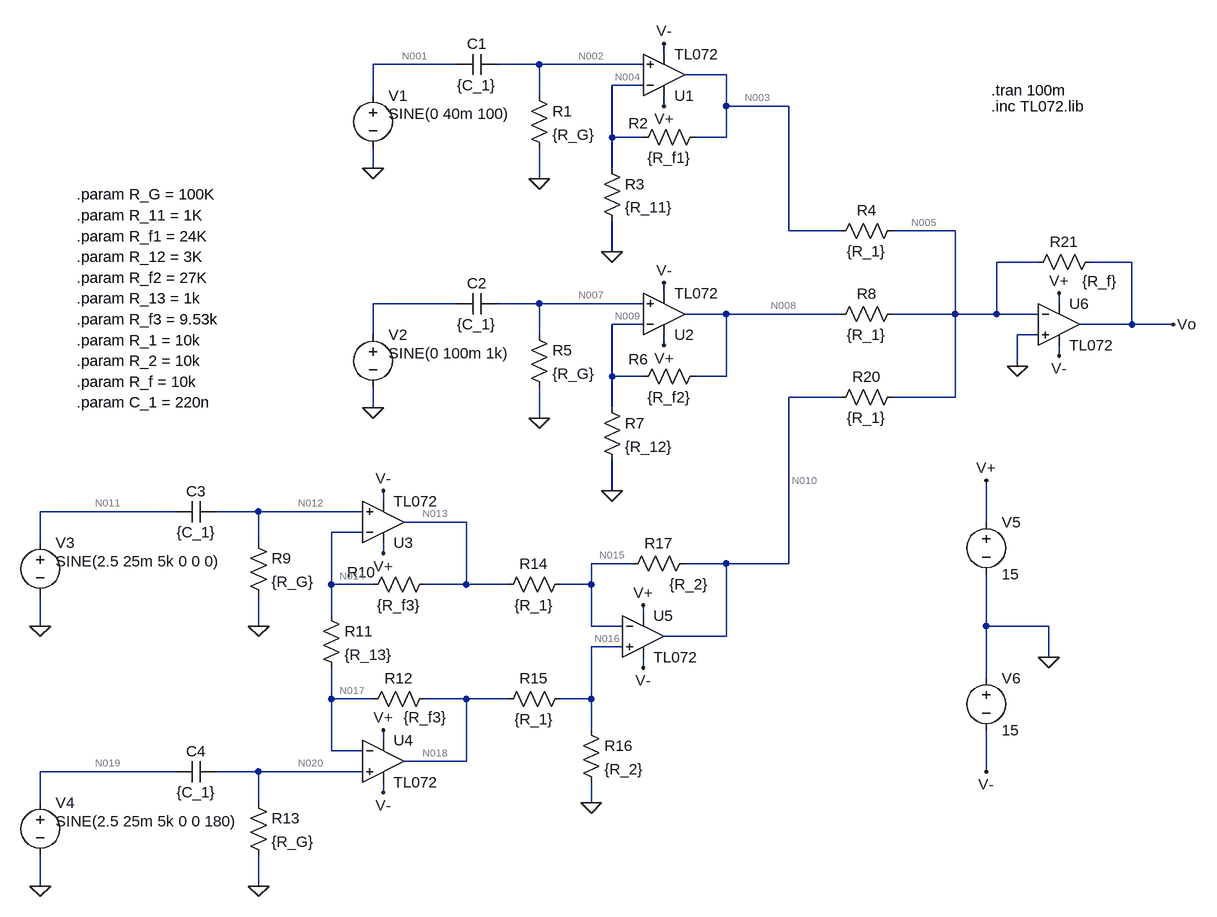
[diagram p0: schematic Mezclador.asc]
Mezclador.asc, the LTspice schematic file:
Version 4.1
SHEET 1 1080 1544
WIRE 208 80 208 64
WIRE -112 96 -240 96
WIRE 16 96 -48 96
WIRE 176 96 16 96
WIRE 304 112 240 112
WIRE 176 128 128 128
WIRE -240 144 -240 96
WIRE 16 144 16 96
WIRE 208 160 208 144
WIRE 304 160 304 112
WIRE 400 160 304 160
WIRE 128 208 128 128
WIRE 176 208 128 208
WIRE 304 208 304 160
WIRE 304 208 256 208
WIRE -240 256 -240 224
WIRE 128 256 128 208
WIRE 16 272 16 224
WIRE 400 352 400 160
WIRE 480 352 400 352
WIRE 656 352 560 352
WIRE 128 384 128 336
WIRE 784 400 720 400
WIRE 928 400 864 400
WIRE 208 448 208 432
WIRE -112 464 -240 464
WIRE 16 464 -48 464
WIRE 176 464 16 464
WIRE 816 464 816 448
WIRE 304 480 240 480
WIRE 480 480 304 480
WIRE 656 480 656 352
WIRE 656 480 560 480
WIRE 720 480 720 400
WIRE 720 480 656 480
WIRE 784 480 720 480
WIRE 176 496 128 496
WIRE 928 496 928 400
WIRE 928 496 848 496
WIRE 992 496 928 496
WIRE -240 512 -240 464
WIRE 16 512 16 464
WIRE 784 512 752 512
WIRE 208 528 208 512
WIRE 816 544 816 528
WIRE 752 560 752 512
WIRE 128 576 128 496
WIRE 176 576 128 576
WIRE 304 576 304 480
WIRE 304 576 256 576
WIRE 480 608 400 608
WIRE 656 608 656 480
WIRE 656 608 560 608
WIRE -240 624 -240 592
WIRE 128 624 128 576
WIRE 16 640 16 592
WIRE 128 752 128 704
WIRE -224 768 -224 752
WIRE -544 784 -752 784
WIRE -416 784 -480 784
WIRE -256 784 -416 784
WIRE -96 800 -192 800
WIRE 704 800 704 736
WIRE -256 816 -304 816
WIRE -752 832 -752 784
WIRE -416 832 -416 784
WIRE -224 848 -224 832
WIRE 160 864 96 864
WIRE 304 864 240 864
WIRE 400 864 400 608
WIRE 400 864 304 864
WIRE -304 896 -304 816
WIRE -240 896 -304 896
WIRE -96 896 -96 800
WIRE -96 896 -160 896
WIRE -32 896 -96 896
WIRE 96 896 96 864
WIRE 96 896 48 896
WIRE -304 944 -304 896
WIRE 176 944 176 928
WIRE -752 960 -752 912
WIRE -416 960 -416 912
WIRE 96 960 96 896
WIRE 144 960 96 960
WIRE 704 960 704 880
WIRE 800 960 704 960
WIRE 304 976 304 864
WIRE 304 976 208 976
WIRE 144 992 96 992
WIRE 800 1008 800 960
WIRE 176 1024 176 1008
WIRE 704 1040 704 960
WIRE -304 1072 -304 1024
WIRE -240 1072 -304 1072
WIRE -96 1072 -160 1072
WIRE -32 1072 -96 1072
WIRE 96 1072 96 992
WIRE 96 1072 48 1072
WIRE 96 1120 96 1072
WIRE -224 1136 -224 1120
WIRE -304 1152 -304 1072
WIRE -256 1152 -304 1152
WIRE -96 1168 -96 1072
WIRE -96 1168 -192 1168
WIRE -544 1184 -752 1184
WIRE -416 1184 -480 1184
WIRE -256 1184 -416 1184
WIRE 704 1184 704 1120
WIRE -224 1216 -224 1200
WIRE -752 1232 -752 1184
WIRE -416 1232 -416 1184
WIRE 96 1232 96 1200
WIRE -752 1360 -752 1312
WIRE -416 1360 -416 1312
FLAG 128 384 0
FLAG 128 752 0
FLAG 752 560 0
FLAG 16 272 0
FLAG 16 640 0
FLAG 992 496 Vo
FLAG -416 960 0
FLAG -416 1360 0
FLAG 96 1232 0
FLAG -752 960 0
FLAG -752 1360 0
FLAG -240 624 0
FLAG -240 256 0
FLAG 800 1008 0
FLAG 704 736 V+
FLAG 704 1184 V-
FLAG 208 160 V+
FLAG 208 528 V+
FLAG 816 448 V+
FLAG -224 848 V+
FLAG -224 1120 V+
FLAG 176 928 V+
FLAG 176 1024 V-
FLAG -224 1216 V-
FLAG -224 752 V-
FLAG 208 432 V-
FLAG 208 64 V-
FLAG 816 544 V-
SYMBOL res 272 192 R90
WINDOW 0 10 103 VBottom 2
WINDOW 3 32 56 VTop 2
SYMATTR InstName R2
SYMATTR Value {R_f1}
SYMBOL res 112 240 R0
SYMATTR InstName R3
SYMATTR Value {R_11}
SYMBOL res 272 560 R90
WINDOW 0 5 103 VBottom 2
WINDOW 3 32 56 VTop 2
SYMATTR InstName R6
SYMATTR Value {R_f2}
SYMBOL res 112 608 R0
SYMATTR InstName R7
SYMATTR Value {R_12}
SYMBOL res 576 464 R90
WINDOW 0 0 56 VBottom 2
WINDOW 3 32 56 VTop 2
SYMATTR InstName R8
SYMATTR Value {R_1}
SYMBOL res 576 336 R90
WINDOW 0 0 56 VBottom 2
WINDOW 3 32 56 VTop 2
SYMATTR InstName R4
SYMATTR Value {R_1}
SYMBOL res 576 592 R90
WINDOW 0 0 56 VBottom 2
WINDOW 3 32 56 VTop 2
SYMATTR InstName R20
SYMATTR Value {R_1}
SYMBOL res 880 384 R90
WINDOW 0 0 56 VBottom 2
WINDOW 3 30 1 VTop 2
SYMATTR InstName R21
SYMATTR Value {R_f}
SYMBOL cap -48 80 R90
WINDOW 0 0 32 VBottom 2
WINDOW 3 32 32 VTop 2
SYMATTR InstName C1
SYMATTR Value {C_1}
SYMBOL res 0 128 R0
SYMATTR InstName R1
SYMATTR Value {R_G}
SYMBOL cap -48 448 R90
WINDOW 0 0 32 VBottom 2
WINDOW 3 32 32 VTop 2
SYMATTR InstName C2
SYMATTR Value {C_1}
SYMBOL res 0 496 R0
SYMATTR InstName R5
SYMATTR Value {R_G}
SYMBOL cap -480 768 R90
WINDOW 0 0 32 VBottom 2
WINDOW 3 32 32 VTop 2
SYMATTR InstName C3
SYMATTR Value {C_1}
SYMBOL res -432 816 R0
SYMATTR InstName R9
SYMATTR Value {R_G}
SYMBOL cap -480 1168 R90
WINDOW 0 0 32 VBottom 2
WINDOW 3 32 32 VTop 2
SYMATTR InstName C4
SYMATTR Value {C_1}
SYMBOL res -432 1216 R0
SYMATTR InstName R13
SYMATTR Value {R_G}
SYMBOL res -144 880 R90
WINDOW 0 13 114 VBottom 2
WINDOW 3 32 56 VTop 2
SYMATTR InstName R10
SYMATTR Value {R_f3}
SYMBOL res -256 1088 R270
WINDOW 0 32 56 VTop 2
WINDOW 3 3 97 VBottom 2
SYMATTR InstName R12
SYMATTR Value {R_f3}
SYMBOL res -320 928 R0
SYMATTR InstName R11
SYMATTR Value {R_13}
SYMBOL res 64 1056 R90
WINDOW 0 0 56 VBottom 2
WINDOW 3 32 56 VTop 2
SYMATTR InstName R15
SYMATTR Value {R_1}
SYMBOL res 64 880 R90
WINDOW 0 0 56 VBottom 2
WINDOW 3 32 56 VTop 2
SYMATTR InstName R14
SYMATTR Value {R_1}
SYMBOL res 80 1104 R0
SYMATTR InstName R16
SYMATTR Value {R_2}
SYMBOL res 256 848 R90
WINDOW 0 0 56 VBottom 2
WINDOW 3 32 9 VTop 2
SYMATTR InstName R17
SYMATTR Value {R_2}
SYMBOL voltage -240 128 R0
WINDOW 123 24 44 Left 2
WINDOW 39 0 0 Left 0
WINDOW 3 24 44 Left 2
SYMATTR Value SINE(0 40m 100)
SYMATTR InstName V1
SYMBOL voltage -240 496 R0
WINDOW 123 24 44 Left 2
WINDOW 39 0 0 Left 0
WINDOW 3 24 44 Left 2
SYMATTR Value SINE(0 100m 1k)
SYMATTR InstName V2
SYMBOL voltage -752 816 R0
WINDOW 123 24 44 Left 2
WINDOW 39 0 0 Left 0
WINDOW 3 24 44 Left 2
SYMATTR Value SINE(2.5 25m 5k 0 0 0)
SYMATTR InstName V3
SYMBOL voltage -752 1216 R0
WINDOW 123 24 44 Left 2
WINDOW 39 0 0 Left 0
WINDOW 3 24 44 Left 2
SYMATTR Value SINE(2.5 25m 5k 0 0 180)
SYMATTR InstName V4
SYMBOL OpAmps\\opamp2 208 176 M180
SYMATTR InstName U1
SYMATTR Value TL072
SYMBOL OpAmps\\opamp2 208 544 M180
SYMATTR InstName U2
SYMATTR Value TL072
SYMBOL OpAmps\\opamp2 -224 864 M180
SYMATTR InstName U3
SYMATTR Value TL072
SYMBOL OpAmps\\opamp2 -224 1104 R0
SYMATTR InstName U4
SYMATTR Value TL072
SYMBOL OpAmps\\opamp2 176 912 R0
SYMATTR InstName U5
SYMATTR Value TL072
SYMBOL OpAmps\\opamp2 816 432 R0
SYMATTR InstName U6
SYMATTR Value TL072
SYMBOL voltage 704 784 R0
SYMATTR InstName V5
SYMATTR Value 15
SYMBOL voltage 704 1024 R0
SYMATTR InstName V6
SYMATTR Value 15
TEXT -696 328 Left 2 !.param R_11 = 1K
TEXT -696 360 Left 2 !.param R_f1 = 24K
TEXT -696 392 Left 2 !.param R_12 = 3K
TEXT -696 424 Left 2 !.param R_f2 = 27K
TEXT -696 296 Left 2 !.param R_G = 100K
TEXT -696 520 Left 2 !.param R_1 = 10k
TEXT -696 552 Left 2 !.param R_2 = 10k
TEXT -696 616 Left 2 !.param C_1 = 220n
TEXT -696 488 Left 2 !.param R_f3 = 9.53k
TEXT -696 456 Left 2 !.param R_13 = 1k
TEXT -696 584 Left 2 !.param R_f = 10k
TEXT 712 160 Left 2 !.inc TL072.lib
TEXT 712 136 Left 2 !.tran 100m

The netlist it stands for:
* Mezclador.asc
R2 N003 N004 {R_f1}
R3 N004 0 {R_11}
R6 N008 N009 {R_f2}
R7 N009 0 {R_12}
R8 N005 N008 {R_1}
R4 N005 N003 {R_1}
R20 N005 N010 {R_1}
R21 Vo N005 {R_f}
C1 N002 N001 {C_1}
R1 N002 0 {R_G}
C2 N007 N006 {C_1}
R5 N007 0 {R_G}
C3 N012 N011 {C_1}
R9 N012 0 {R_G}
C4 N020 N019 {C_1}
R13 N020 0 {R_G}
R10 N013 N014 {R_f3}
R12 N017 N018 {R_f3}
R11 N014 N017 {R_13}
R15 N016 N018 {R_1}
R14 N015 N013 {R_1}
R16 N016 0 {R_2}
R17 N010 N015 {R_2}
V1 N001 0 SINE(0 40m 100)
V2 N006 0 SINE(0 100m 1k)
V3 N011 0 SINE(2.5 25m 5k 0 0 0)
V4 N019 0 SINE(2.5 25m 5k 0 0 180)
X§U1 N002 N004 V+ V- N003 TL072  ; pins In+ In- V+ V- OUT
X§U2 N007 N009 V+ V- N008 TL072  ; pins In+ In- V+ V- OUT
X§U3 N012 N014 V+ V- N013 TL072  ; pins In+ In- V+ V- OUT
X§U4 N020 N017 V+ V- N018 TL072  ; pins In+ In- V+ V- OUT
X§U5 N016 N015 V+ V- N010 TL072  ; pins In+ In- V+ V- OUT
X§U6 0 N005 V+ V- Vo TL072  ; pins In+ In- V+ V- OUT
V5 V+ 0 15
V6 0 V- 15
.param R_11 = 1K
.param R_f1 = 24K
.param R_12 = 3K
.param R_f2 = 27K
.param R_G = 100K
.param R_1 = 10k
.param R_2 = 10k
.param C_1 = 220n
.param R_f3 = 9.53k
.param R_13 = 1k
.param R_f = 10k
.inc TL072.lib
.tran 100m
.backanno
.end

* Results of the author's LTspice run, read from the files saved beside the schematic
* Operating Point, zero values left out:
*   V(n002) = -4.505 µV
*   V(n003) = 162.7 µV
*   V(n004) = 6.465 µV
*   V(n005) = 10.97 µV
*   V(n007) = -4.505 µV
*   V(n008) = 65.87 µV
*   V(n009) = 6.465 µV
*   V(n010) = 21.94 µV
*   V(n011) = 2.5 V
*   V(n012) = -4.505 µV
*   V(n013) = 6.895 µV
*   V(n014) = 6.465 µV
*   V(n015) = 14.19 µV
*   V(n016) = 3.222 µV
*   V(n017) = 6.465 µV
*   V(n018) = 6.895 µV
*   V(n019) = 2.5 V
*   V(n020) = -4.505 µV
*   V(v+) = 15 V
*   V(v-) = -15 V
*   V(vo) = -206.2 µV
*   I(R1) = -45.05 pA
*   I(R10) = 45.05 pA
*   I(R12) = -45.05 pA
*   I(R13) = -45.05 pA
*   I(R14) = 729.8 pA
*   I(R15) = -367.3 pA
*   I(R16) = 322.2 pA
*   I(R17) = 774.8 pA
*   I(R2) = 6.51 nA
*   I(R20) = -1.097 nA
*   I(R21) = -21.71 nA
*   I(R3) = 6.465 nA
*   I(R4) = -15.17 nA
*   I(R5) = -45.05 pA
*   I(R6) = 2.2 nA
*   I(R7) = 2.155 nA
*   I(R8) = -5.49 nA
*   I(R9) = -45.05 pA
*   I(V5) = -9.569 mA
*   I(V6) = -9.572 mA
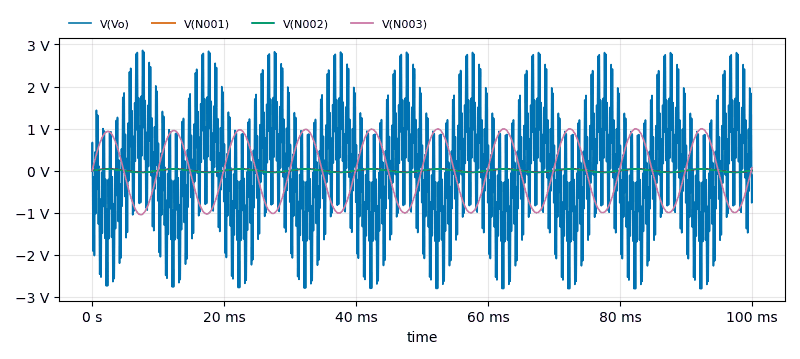
[diagram p1: Transient Analysis of Mezclador.asc, plotted from the saved traces]
* Transient Analysis, 1 run:
*   V(Vo): min -2.81 V, max 2.86 V, average 16.71 mV, rms 1.226 V, last -110.9 mV
*   V(N001): min -40 mV, max 40 mV, average 0 V, rms 28.28 mV, last 0 V
*   V(N002): min -41.96 mV, max 39.85 mV, average -631.1 µV, rms 28.16 mV, last 2.844 mV
*   V(N003): min -1.049 V, max 996.3 mV, average -15.5 mV, rms 704 mV, last 70.62 mV